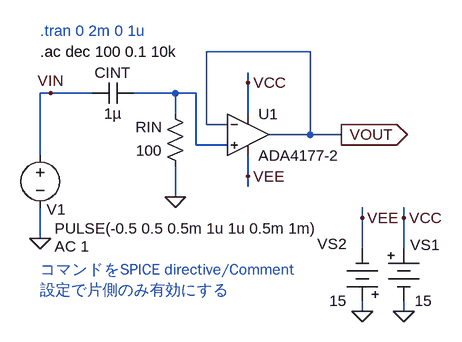
[diagram p0: schematic fig-01-03-28.asc]
fig-01-03-28.asc, the LTspice schematic file:
Version 4
SHEET 1 880 680
WIRE 304 -48 144 -48
WIRE 208 0 208 -16
WIRE -96 16 -112 16
WIRE -32 16 -96 16
WIRE 96 16 32 16
WIRE 128 16 96 16
WIRE 96 48 96 16
WIRE 208 48 208 0
WIRE 144 64 144 -48
WIRE 176 64 144 64
WIRE 304 80 304 -48
WIRE 304 80 240 80
WIRE 352 80 304 80
WIRE 128 96 128 16
WIRE 176 96 128 96
WIRE -112 112 -112 16
WIRE 208 144 208 112
WIRE 208 160 208 144
WIRE 96 176 96 128
WIRE 384 208 384 192
WIRE 448 208 448 192
WIRE -112 240 -112 192
WIRE 384 256 384 208
WIRE 448 256 448 208
WIRE 384 352 384 336
WIRE 448 352 448 336
FLAG -112 240 0
FLAG -96 16 VIN
FLAG 384 352 0
FLAG 448 352 0
FLAG 384 208 VEE
FLAG 448 208 VCC
FLAG 208 0 VCC
FLAG 208 144 VEE
FLAG 352 80 VOUT
IOPIN 352 80 Out
FLAG 96 176 0
SYMBOL voltage -112 96 R0
WINDOW 0 10 99 Left 2
WINDOW 3 22 128 Left 2
WINDOW 123 22 156 Left 2
WINDOW 39 0 0 Left 0
SYMATTR InstName V1
SYMATTR Value PULSE(-0.5 0.5 0.5m 1u 1u 0.5m 1m)
SYMATTR Value2 AC 1
SYMBOL Misc\\battery 448 240 R0
WINDOW 0 10 10 Left 2
WINDOW 3 17 96 Left 2
SYMATTR InstName VS1
SYMATTR Value 15
SYMBOL Misc\\battery 384 352 R180
WINDOW 0 24 104 Left 2
WINDOW 3 24 16 Left 2
SYMATTR InstName VS2
SYMATTR Value 15
SYMBOL res 112 144 R180
WINDOW 0 36 76 Left 2
WINDOW 3 36 40 Left 2
SYMATTR InstName RIN
SYMATTR Value 100
SYMBOL cap 32 0 R90
WINDOW 0 0 32 VBottom 2
WINDOW 3 32 32 VTop 2
SYMATTR InstName CINT
SYMATTR Value 1µ
SYMBOL Opamps\\ADA4177-2 208 80 R0
SYMATTR InstName U1
TEXT -112 -80 Left 2 ;.tran 0 2m 0 1u
TEXT -112 -48 Left 2 !.ac dec 100 0.1 10k
TEXT -112 288 Left 2 ;コマンドをSPICE directive/Comment
TEXT -112 320 Left 2 ;設定で片側のみ有効にする

The netlist it stands for:
* fig-01-03-28.asc
V1 VIN 0 PULSE(-0.5 0.5 0.5m 1u 1u 0.5m 1m) AC 1
VS1 VCC 0 15
VS2 0 VEE 15
RIN 0 N001 100
CINT N001 VIN 1µ
* U1: ADA4177-2 (symbol Opamps\ADA4177-2 not available, pins judged from their places): In+=N001 In-=VOUT V+=VCC V-=VEE OUT=VOUT
* .tran 0 2m 0 1u
.ac dec 100 0.1 10k
* コマンドをSPICE directive/Comment
* 設定で片側のみ有効にする
.backanno
.end